# EAGLE schematic untitled (EAGLE 6.1)
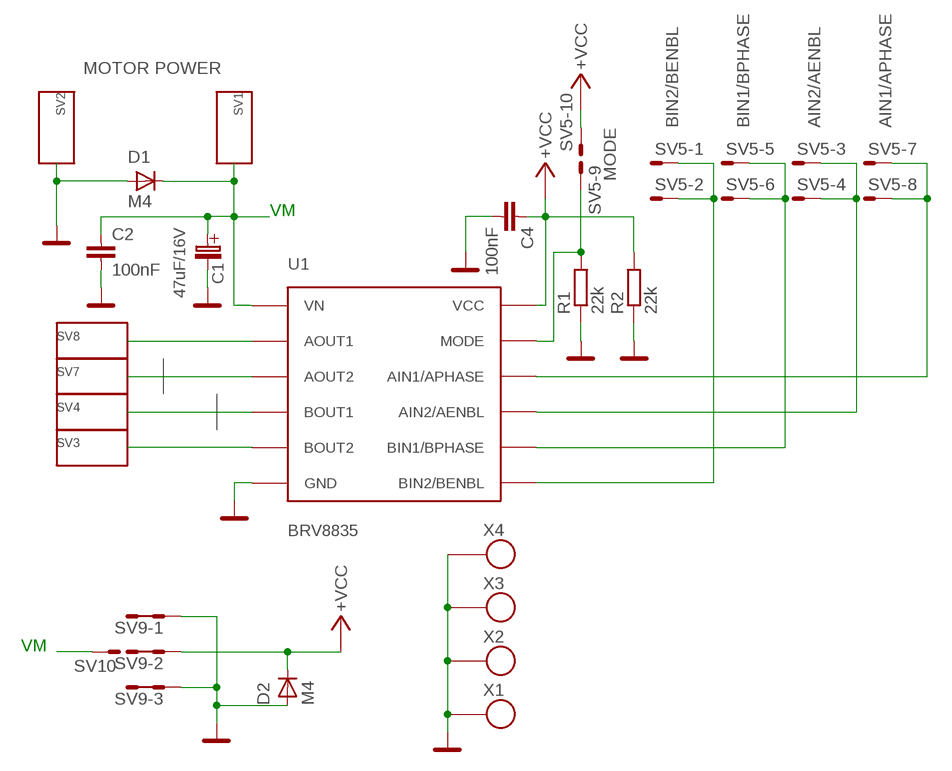
[diagram p0: schematic, sheet 1]

## Parts
C1  47uF/16V  C  [C]
C2  100nF  C0805  [C0805]
C4  100nF  C0805  [C0805]
D1  M4  D-OB.SMA  [SMA]
D2  M4  D-OB.SMA  [SMA]
R1  22k  R0805  [0805]
R2  22k  R0805  [0805]
SV1  WAGO256  [WAGO256]
SV2  WAGO256  [WAGO256]
SV3  WAGO256  [WAGO256]
SV4  WAGO256  [WAGO256]
SV5  MA05-3  [MA05-2]
SV7  WAGO256  [WAGO256]
SV8  WAGO256  [WAGO256]
SV9  MA03-2  [MA03-2]
SV10  MA01-1  [MA01-1]
U1  BRV8835  DRV8835  [WSON]
X1  SROUB3M  [SROUB3M]
X2  SROUB3M  [SROUB3M]
X3  SROUB3M  [SROUB3M]
X4  SROUB3M  [SROUB3M]

## Nets
+VCC: C4.1 D2.K(C) R2.2 SV5.10 SV9.3 SV9.4 U1.12(VCC)
GND: C1.-(C_EL-) C2.2 C4.2 D1.A D2.A R1.1 R2.1 SV2.1 SV2.A1 SV9.1 SV9.2 SV9.5 SV9.6 U1.6(GND) U1.P1(GND) U1.P2(GND) U1.P3(GND) U1.P4(GND) U1.P5(GND) U1.P6(GND) U1.P7(GND) U1.P8(GND) X1.P$1 X2.P$1 X3.P$1 X4.P$1
N$1: SV3.1 SV3.A1 U1.5(BOUT2)
N$2: SV5.5 SV5.6 U1.8(BIN1/BPHASE)
N$3: SV4.1 SV4.A1 U1.4(BOUT1)
N$4: SV7.1 SV7.A1 U1.3(AOUT2)
N$5: SV8.1 SV8.A1 U1.2(AOUT1)
N$8: SV5.1 SV5.2 U1.7(BIN2/BENBL)
N$9: R1.2 SV5.9 U1.11(MODE)
N$11: SV5.3 SV5.4 U1.9(AIN2/AENBL)
N$13: SV5.7 SV5.8 U1.10(AIN1/APHASE)
VN: C1.+(C_EL+) C2.1 D1.K(C) SV1.1 SV1.A1 SV10.1 U1.1(VN)

## Notes on the sheet
- MOTOR POWER
- BIN2/BENBL | BIN1/BPHASE | AIN2/AENBL | AIN1/APHASE
- MODE
- VM
- VM

## Library data of the parts
C1 = moje_C:C
C2 C4 = moje_C:C0805
D1 D2 = moje:D-OB.SMA: SMA
R1 R2 = moje_R:R0805
SV1-SV4 SV7 SV8 = moje_konektory:WAGO256: WAGO256
SV5 = moje_hrebinky:MA05-3
SV9 = moje_hrebinky:MA03-2: PIN HEADER; OC_FARNELL: unknown; OC_NEWARK: unknown
SV10 = moje_hrebinky:MA01-1
U1 = moje_io:DRV8835: DRV8835 IO pro dva dc motory 2x1,5A
X1-X4 = moje:SROUB3M